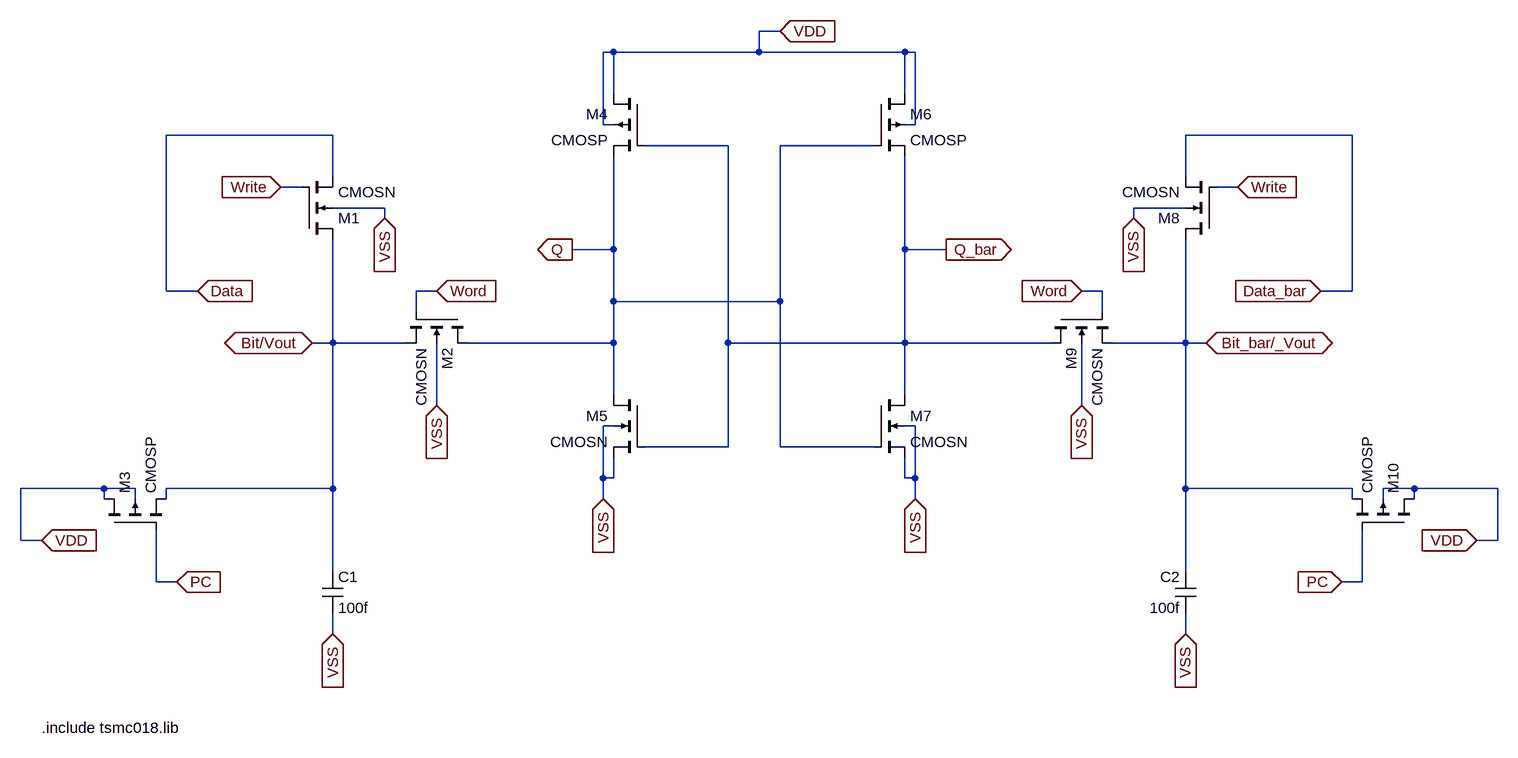
[diagram p0: schematic 1-bit_6T_SRAM_Cell.asc]
1-bit_6T_SRAM_Cell.asc, the LTspice schematic file:
Version 4.1
SHEET 1 2284 680
WIRE 848 -768 816 -768
WIRE 592 -736 576 -736
WIRE 816 -736 816 -768
WIRE 816 -736 592 -736
WIRE 1040 -736 816 -736
WIRE 1056 -736 1040 -736
WIRE 592 -672 592 -736
WIRE 1040 -672 1040 -736
WIRE 576 -624 576 -736
WIRE 592 -624 576 -624
WIRE 1056 -624 1056 -736
WIRE 1056 -624 1040 -624
WIRE 160 -608 -96 -608
WIRE 1728 -608 1472 -608
WIRE 768 -592 640 -592
WIRE 992 -592 848 -592
WIRE 160 -544 160 -608
WIRE 1472 -544 1472 -608
WIRE 112 -528 80 -528
WIRE 1552 -528 1520 -528
WIRE 240 -496 160 -496
WIRE 1472 -496 1392 -496
WIRE 240 -480 240 -496
WIRE 1392 -480 1392 -496
WIRE 592 -432 592 -576
WIRE 592 -432 528 -432
WIRE 1040 -432 1040 -576
WIRE 1104 -432 1040 -432
WIRE -96 -368 -96 -608
WIRE -48 -368 -96 -368
WIRE 320 -368 288 -368
WIRE 1344 -368 1312 -368
WIRE 1728 -368 1728 -608
WIRE 1728 -368 1680 -368
WIRE 592 -352 592 -432
WIRE 848 -352 848 -592
WIRE 848 -352 592 -352
WIRE 288 -336 288 -368
WIRE 1344 -336 1344 -368
WIRE 160 -288 160 -448
WIRE 160 -288 128 -288
WIRE 272 -288 160 -288
WIRE 592 -288 592 -352
WIRE 592 -288 368 -288
WIRE 768 -288 768 -592
WIRE 1040 -288 1040 -432
WIRE 1040 -288 768 -288
WIRE 1264 -288 1040 -288
WIRE 1472 -288 1472 -448
WIRE 1472 -288 1360 -288
WIRE 1504 -288 1472 -288
WIRE 592 -208 592 -288
WIRE 1040 -208 1040 -288
WIRE 320 -192 320 -288
WIRE 1312 -192 1312 -288
WIRE 592 -160 576 -160
WIRE 1056 -160 1040 -160
WIRE 768 -128 768 -288
WIRE 768 -128 640 -128
WIRE 848 -128 848 -352
WIRE 992 -128 848 -128
WIRE 576 -80 576 -160
WIRE 592 -80 592 -112
WIRE 592 -80 576 -80
WIRE 1040 -80 1040 -112
WIRE 1056 -80 1056 -160
WIRE 1056 -80 1040 -80
WIRE -192 -64 -320 -64
WIRE -144 -64 -192 -64
WIRE 160 -64 160 -288
WIRE 160 -64 -96 -64
WIRE 1472 -64 1472 -288
WIRE 1728 -64 1472 -64
WIRE 1824 -64 1776 -64
WIRE 1952 -64 1824 -64
WIRE -192 -48 -192 -64
WIRE -144 -48 -144 -64
WIRE -96 -48 -96 -64
WIRE 576 -48 576 -80
WIRE 1056 -48 1056 -80
WIRE 1728 -48 1728 -64
WIRE 1776 -48 1776 -64
WIRE 1824 -48 1824 -64
WIRE -320 16 -320 -64
WIRE -288 16 -320 16
WIRE 1952 16 1952 -64
WIRE 1952 16 1920 16
WIRE 160 64 160 -64
WIRE 1472 64 1472 -64
WIRE -112 80 -112 0
WIRE -80 80 -112 80
WIRE 1744 80 1744 0
WIRE 1744 80 1712 80
WIRE 160 160 160 128
WIRE 1472 160 1472 128
FLAG -48 -368 Data
IOPIN -48 -368 In
FLAG 80 -528 Write
IOPIN 80 -528 In
FLAG 320 -368 Word
IOPIN 320 -368 In
FLAG -80 80 PC
IOPIN -80 80 In
FLAG -288 16 VDD
IOPIN -288 16 In
FLAG 528 -432 Q
IOPIN 528 -432 Out
FLAG 1104 -432 Q_bar
IOPIN 1104 -432 Out
FLAG 848 -768 VDD
IOPIN 848 -768 In
FLAG 1680 -368 Data_bar
IOPIN 1680 -368 In
FLAG 1552 -528 Write
IOPIN 1552 -528 In
FLAG 1312 -368 Word
IOPIN 1312 -368 In
FLAG 1712 80 PC
IOPIN 1712 80 In
FLAG 1920 16 VDD
IOPIN 1920 16 In
FLAG 128 -288 Bit/Vout
IOPIN 128 -288 BiDir
FLAG 1504 -288 Bit_bar/_Vout
IOPIN 1504 -288 BiDir
FLAG 240 -480 VSS
IOPIN 240 -480 In
FLAG 320 -192 VSS
IOPIN 320 -192 In
FLAG 576 -48 VSS
IOPIN 576 -48 In
FLAG 1056 -48 VSS
IOPIN 1056 -48 In
FLAG 1312 -192 VSS
IOPIN 1312 -192 In
FLAG 1472 160 VSS
IOPIN 1472 160 In
FLAG 1392 -480 VSS
IOPIN 1392 -480 In
FLAG 160 160 VSS
IOPIN 160 160 In
SYMBOL nmos4 112 -448 M180
SYMATTR InstName M1
SYMATTR Value CMOSN
SYMATTR Value2 l=0.5u w=3u
SYMBOL nmos4 368 -336 R90
SYMATTR InstName M2
SYMATTR Value CMOSN
SYMATTR Value2 l=0.3u w=0.6u
SYMBOL cap 144 64 R0
SYMATTR InstName C1
SYMATTR Value 100f
SYMBOL pmos4 -192 0 R270
SYMATTR InstName M3
SYMATTR Value CMOSP
SYMATTR Value2 l=0.5u w=2u
SYMBOL pmos4 640 -672 M0
SYMATTR InstName M4
SYMATTR Value CMOSP
SYMATTR Value2 l=0.3u w=0.39u
SYMBOL nmos4 640 -208 M0
SYMATTR InstName M5
SYMATTR Value CMOSN
SYMATTR Value2 l=0.3u w=1.5u
SYMBOL pmos4 992 -672 R0
SYMATTR InstName M6
SYMATTR Value CMOSP
SYMATTR Value2 l=0.3u w=0.39u
SYMBOL nmos4 992 -208 R0
SYMATTR InstName M7
SYMATTR Value CMOSN
SYMATTR Value2 l=0.3u w=1.5u
SYMBOL nmos4 1520 -448 R180
SYMATTR InstName M8
SYMATTR Value CMOSN
SYMATTR Value2 l=0.5u w=3u
SYMBOL nmos4 1264 -336 M90
SYMATTR InstName M9
SYMATTR Value CMOSN
SYMATTR Value2 l=0.3u w=0.6u
SYMBOL cap 1488 64 M0
SYMATTR InstName C2
SYMATTR Value 100f
SYMBOL pmos4 1824 0 M270
SYMATTR InstName M10
SYMATTR Value CMOSP
SYMATTR Value2 l=0.5u w=2u
TEXT -288 304 Left 2 !.include tsmc018.lib

The netlist it stands for:
* 1-bit_6T_SRAM_Cell.asc
M1 Bit/Vout Write Data VSS CMOSN l=0.5u w=3u
M2 Q Word Bit/Vout VSS CMOSN l=0.3u w=0.6u
C1 Bit/Vout VSS 100f
M3 VDD PC Bit/Vout VDD CMOSP l=0.5u w=2u
M4 VDD Q_bar Q VDD CMOSP l=0.3u w=0.39u
M5 Q Q_bar VSS VSS CMOSN l=0.3u w=1.5u
M6 VDD Q Q_bar VDD CMOSP l=0.3u w=0.39u
M7 Q_bar Q VSS VSS CMOSN l=0.3u w=1.5u
M8 Bit_bar/_Vout Write Data_bar VSS CMOSN l=0.5u w=3u
M9 Q_bar Word Bit_bar/_Vout VSS CMOSN l=0.3u w=0.6u
C2 Bit_bar/_Vout VSS 100f
M10 VDD PC Bit_bar/_Vout VDD CMOSP l=0.5u w=2u
.model NMOS NMOS
.model PMOS PMOS
.lib standard.mos
.include tsmc018.lib
.backanno
.end